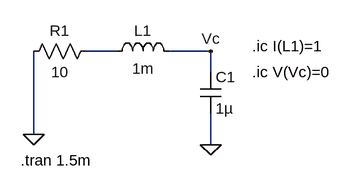
[diagram p0: schematic power_RLC_source_Free_with_inductor_initial_condition.asc]
power_RLC_source_Free_with_inductor_initial_condition.asc, the LTspice schematic file:
Version 4
SHEET 1 880 680
WIRE 128 80 80 80
WIRE 272 80 208 80
WIRE 272 112 272 80
WIRE 0 208 0 80
WIRE 272 224 272 176
FLAG 272 224 0
FLAG 0 208 0
FLAG 272 80 Vc
SYMBOL res 96 64 R90
WINDOW 0 0 56 VBottom 2
WINDOW 3 32 56 VTop 2
SYMATTR InstName R1
SYMATTR Value 10
SYMBOL ind 112 96 R270
WINDOW 0 32 56 VTop 2
WINDOW 3 5 56 VBottom 2
SYMATTR InstName L1
SYMATTR Value 1m
SYMBOL cap 256 112 R0
SYMATTR InstName C1
SYMATTR Value 1µ
TEXT 336 72 Left 2 !.ic I(L1)=1
TEXT 336 112 Left 2 !.ic V(Vc)=0
TEXT -20 248 Left 2 !.tran 1.5m

The netlist it stands for:
* power_RLC_source_Free_with_inductor_initial_condition.asc
R1 N001 0 10
L1 N001 Vc 1m
C1 Vc 0 1µ
.ic I(L1)=1
.ic V(Vc)=0
.tran 1.5m
.backanno
.end